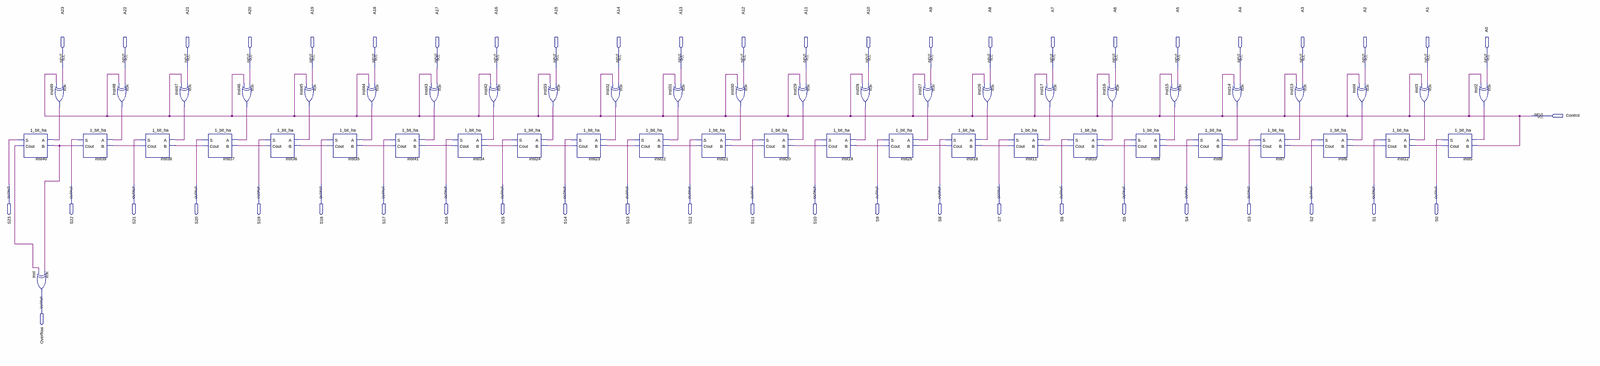
[diagram p0: schematic sheet, whole]
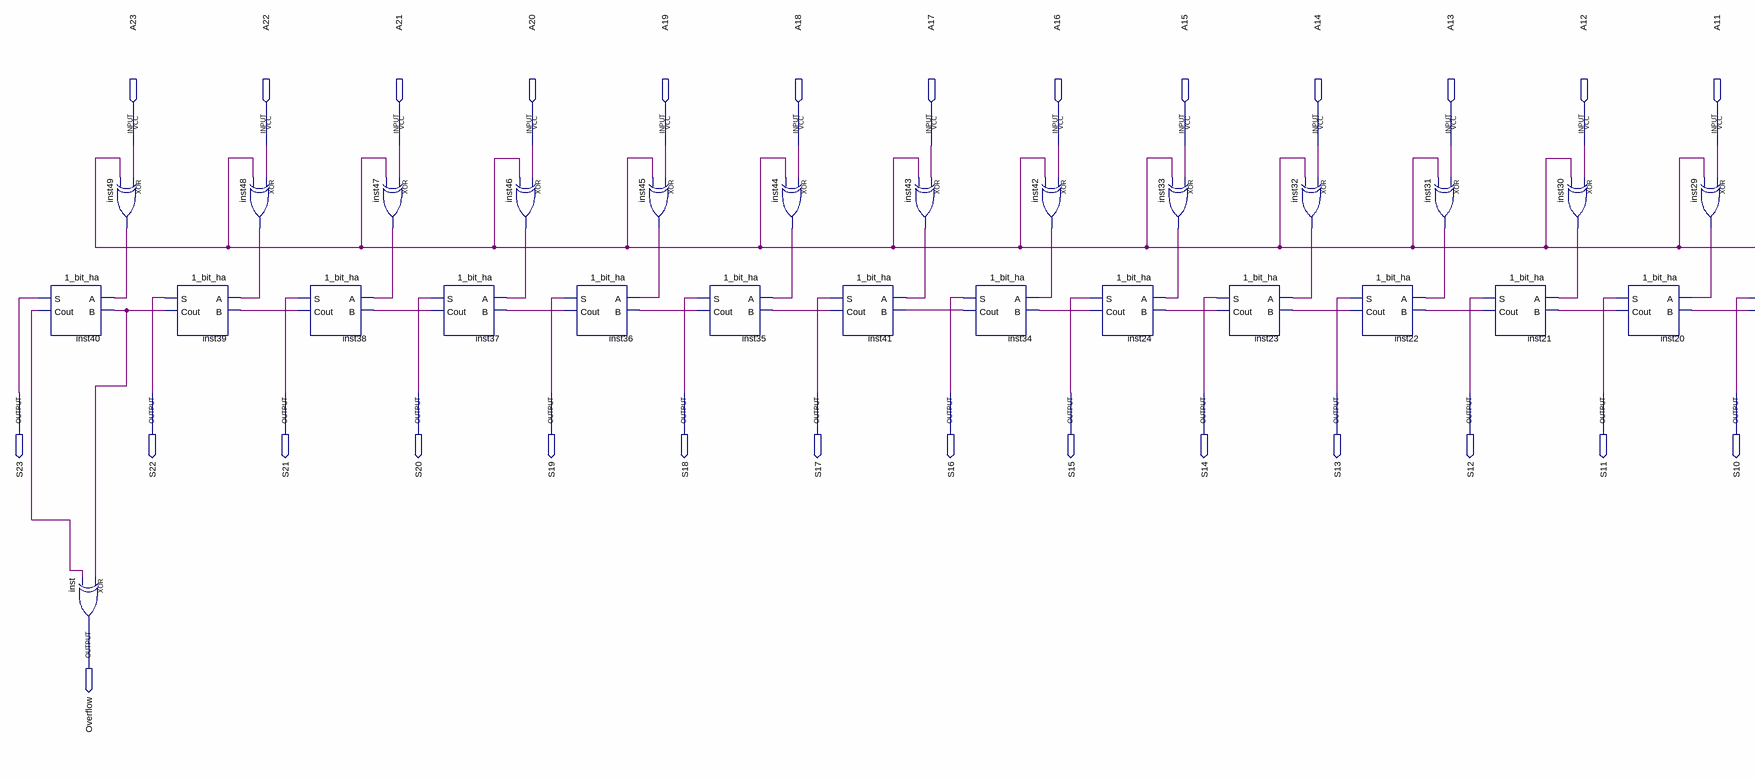
[diagram p1: schematic sheet, left part]
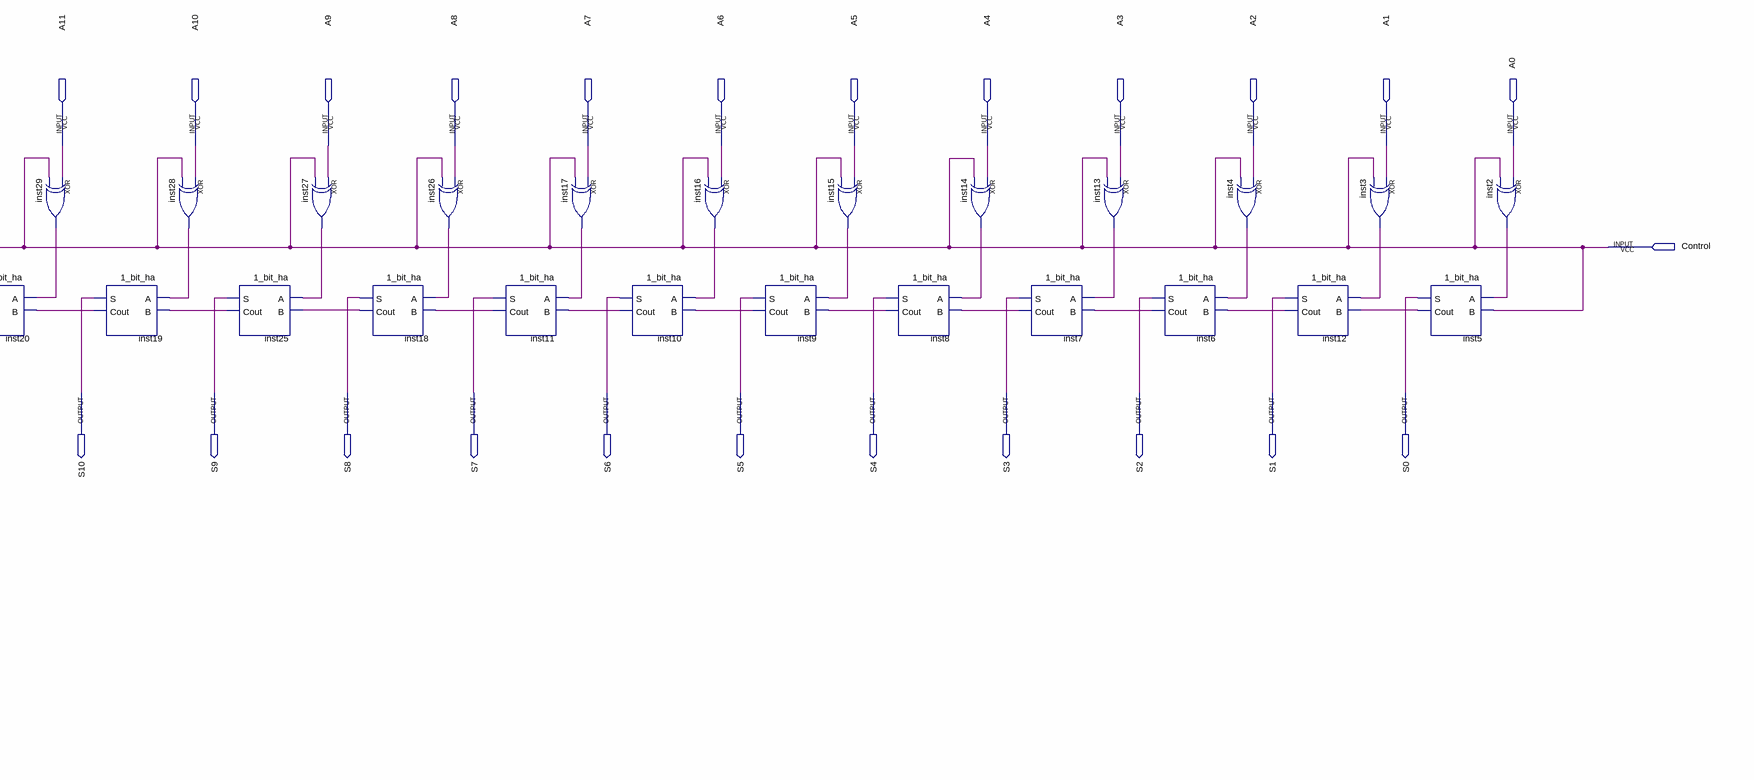
[diagram p2: schematic sheet, right part]
// Quartus schematic 24_bit_twos_complementer.bdf as structural Verilog: 49 symbols, 50 pins
module \24_bit_twos_complementer  (
  input  A23,
  input  A22,
  input  A21,
  input  A20,
  input  A19,
  input  A18,
  input  A17,
  input  A16,
  input  A15,
  input  A14,
  input  A13,
  input  A12,
  input  A11,
  input  A10,
  input  A9,
  input  A8,
  input  A7,
  input  A6,
  input  A5,
  input  A4,
  input  A3,
  input  A2,
  input  A1,
  input  A0,
  input  Control,
  output S23,
  output S22,
  output S21,
  output S20,
  output S19,
  output S18,
  output S17,
  output S16,
  output S15,
  output S14,
  output S13,
  output S12,
  output S11,
  output S10,
  output S9,
  output S8,
  output S7,
  output S6,
  output S5,
  output S4,
  output S3,
  output S2,
  output S1,
  output S0,
  output Overflow
);

  wire inst2_out, inst3_out, inst4_out, inst5_cout, inst6_cout, inst7_cout, inst8_cout, inst9_cout,
       inst10_cout, inst11_cout, inst12_cout, inst13_out, inst14_out, inst15_out, inst16_out, inst17_out,
       inst18_cout, inst19_cout, inst20_cout, inst21_cout, inst22_cout, inst23_cout, inst24_cout,
       inst25_cout, inst26_out, inst27_out, inst28_out, inst29_out, inst30_out, inst31_out, inst32_out,
       inst33_out, inst34_cout, inst35_cout, inst36_cout, inst37_cout, inst38_cout, inst39_cout, inst40_cout,
       inst41_cout, inst42_out, inst43_out, inst44_out, inst45_out, inst46_out, inst47_out, inst48_out,
       inst49_out;

  \1_bit_ha  inst40 (.A(inst49_out), .B(inst39_cout), .S(S23), .Cout(inst40_cout));
  xor inst (Overflow, inst39_cout, inst40_cout);
  xor inst49 (inst49_out, A23, Control);
  \1_bit_ha  inst39 (.A(inst48_out), .B(inst38_cout), .S(S22), .Cout(inst39_cout));
  xor inst48 (inst48_out, A22, Control);
  \1_bit_ha  inst38 (.A(inst47_out), .B(inst37_cout), .S(S21), .Cout(inst38_cout));
  xor inst47 (inst47_out, A21, Control);
  \1_bit_ha  inst37 (.A(inst46_out), .B(inst36_cout), .S(S20), .Cout(inst37_cout));
  xor inst46 (inst46_out, A20, Control);
  \1_bit_ha  inst36 (.A(inst45_out), .B(inst35_cout), .S(S19), .Cout(inst36_cout));
  xor inst45 (inst45_out, A19, Control);
  \1_bit_ha  inst35 (.A(inst44_out), .B(inst41_cout), .S(S18), .Cout(inst35_cout));
  xor inst44 (inst44_out, A18, Control);
  \1_bit_ha  inst41 (.A(inst43_out), .B(inst34_cout), .S(S17), .Cout(inst41_cout));
  xor inst43 (inst43_out, A17, Control);
  \1_bit_ha  inst34 (.A(inst42_out), .B(inst24_cout), .S(S16), .Cout(inst34_cout));
  xor inst42 (inst42_out, A16, Control);
  \1_bit_ha  inst24 (.A(inst33_out), .B(inst23_cout), .S(S15), .Cout(inst24_cout));
  xor inst33 (inst33_out, A15, Control);
  \1_bit_ha  inst23 (.A(inst32_out), .B(inst22_cout), .S(S14), .Cout(inst23_cout));
  xor inst32 (inst32_out, A14, Control);
  \1_bit_ha  inst22 (.A(inst31_out), .B(inst21_cout), .S(S13), .Cout(inst22_cout));
  xor inst31 (inst31_out, A13, Control);
  \1_bit_ha  inst21 (.A(inst30_out), .B(inst20_cout), .S(S12), .Cout(inst21_cout));
  xor inst30 (inst30_out, A12, Control);
  \1_bit_ha  inst20 (.A(inst29_out), .B(inst19_cout), .S(S11), .Cout(inst20_cout));
  xor inst29 (inst29_out, A11, Control);
  \1_bit_ha  inst19 (.A(inst28_out), .B(inst25_cout), .S(S10), .Cout(inst19_cout));
  xor inst28 (inst28_out, A10, Control);
  \1_bit_ha  inst25 (.A(inst27_out), .B(inst18_cout), .S(S9), .Cout(inst25_cout));
  xor inst27 (inst27_out, A9, Control);
  \1_bit_ha  inst18 (.A(inst26_out), .B(inst11_cout), .S(S8), .Cout(inst18_cout));
  xor inst26 (inst26_out, A8, Control);
  \1_bit_ha  inst11 (.A(inst17_out), .B(inst10_cout), .S(S7), .Cout(inst11_cout));
  xor inst17 (inst17_out, A7, Control);
  \1_bit_ha  inst10 (.A(inst16_out), .B(inst9_cout), .S(S6), .Cout(inst10_cout));
  xor inst16 (inst16_out, A6, Control);
  \1_bit_ha  inst9 (.A(inst15_out), .B(inst8_cout), .S(S5), .Cout(inst9_cout));
  xor inst15 (inst15_out, A5, Control);
  \1_bit_ha  inst8 (.A(inst14_out), .B(inst7_cout), .S(S4), .Cout(inst8_cout));
  xor inst14 (inst14_out, A4, Control);
  \1_bit_ha  inst7 (.A(inst13_out), .B(inst6_cout), .S(S3), .Cout(inst7_cout));
  xor inst13 (inst13_out, A3, Control);
  \1_bit_ha  inst6 (.A(inst4_out), .B(inst12_cout), .S(S2), .Cout(inst6_cout));
  xor inst4 (inst4_out, A2, Control);
  \1_bit_ha  inst12 (.A(inst3_out), .B(inst5_cout), .S(S1), .Cout(inst12_cout));
  xor inst3 (inst3_out, A1, Control);
  \1_bit_ha  inst5 (.A(inst2_out), .B(Control), .S(S0), .Cout(inst5_cout));
  xor inst2 (inst2_out, A0, Control);
endmodule
